# EAGLE design T00R20 (EAGLE 9.2.2)
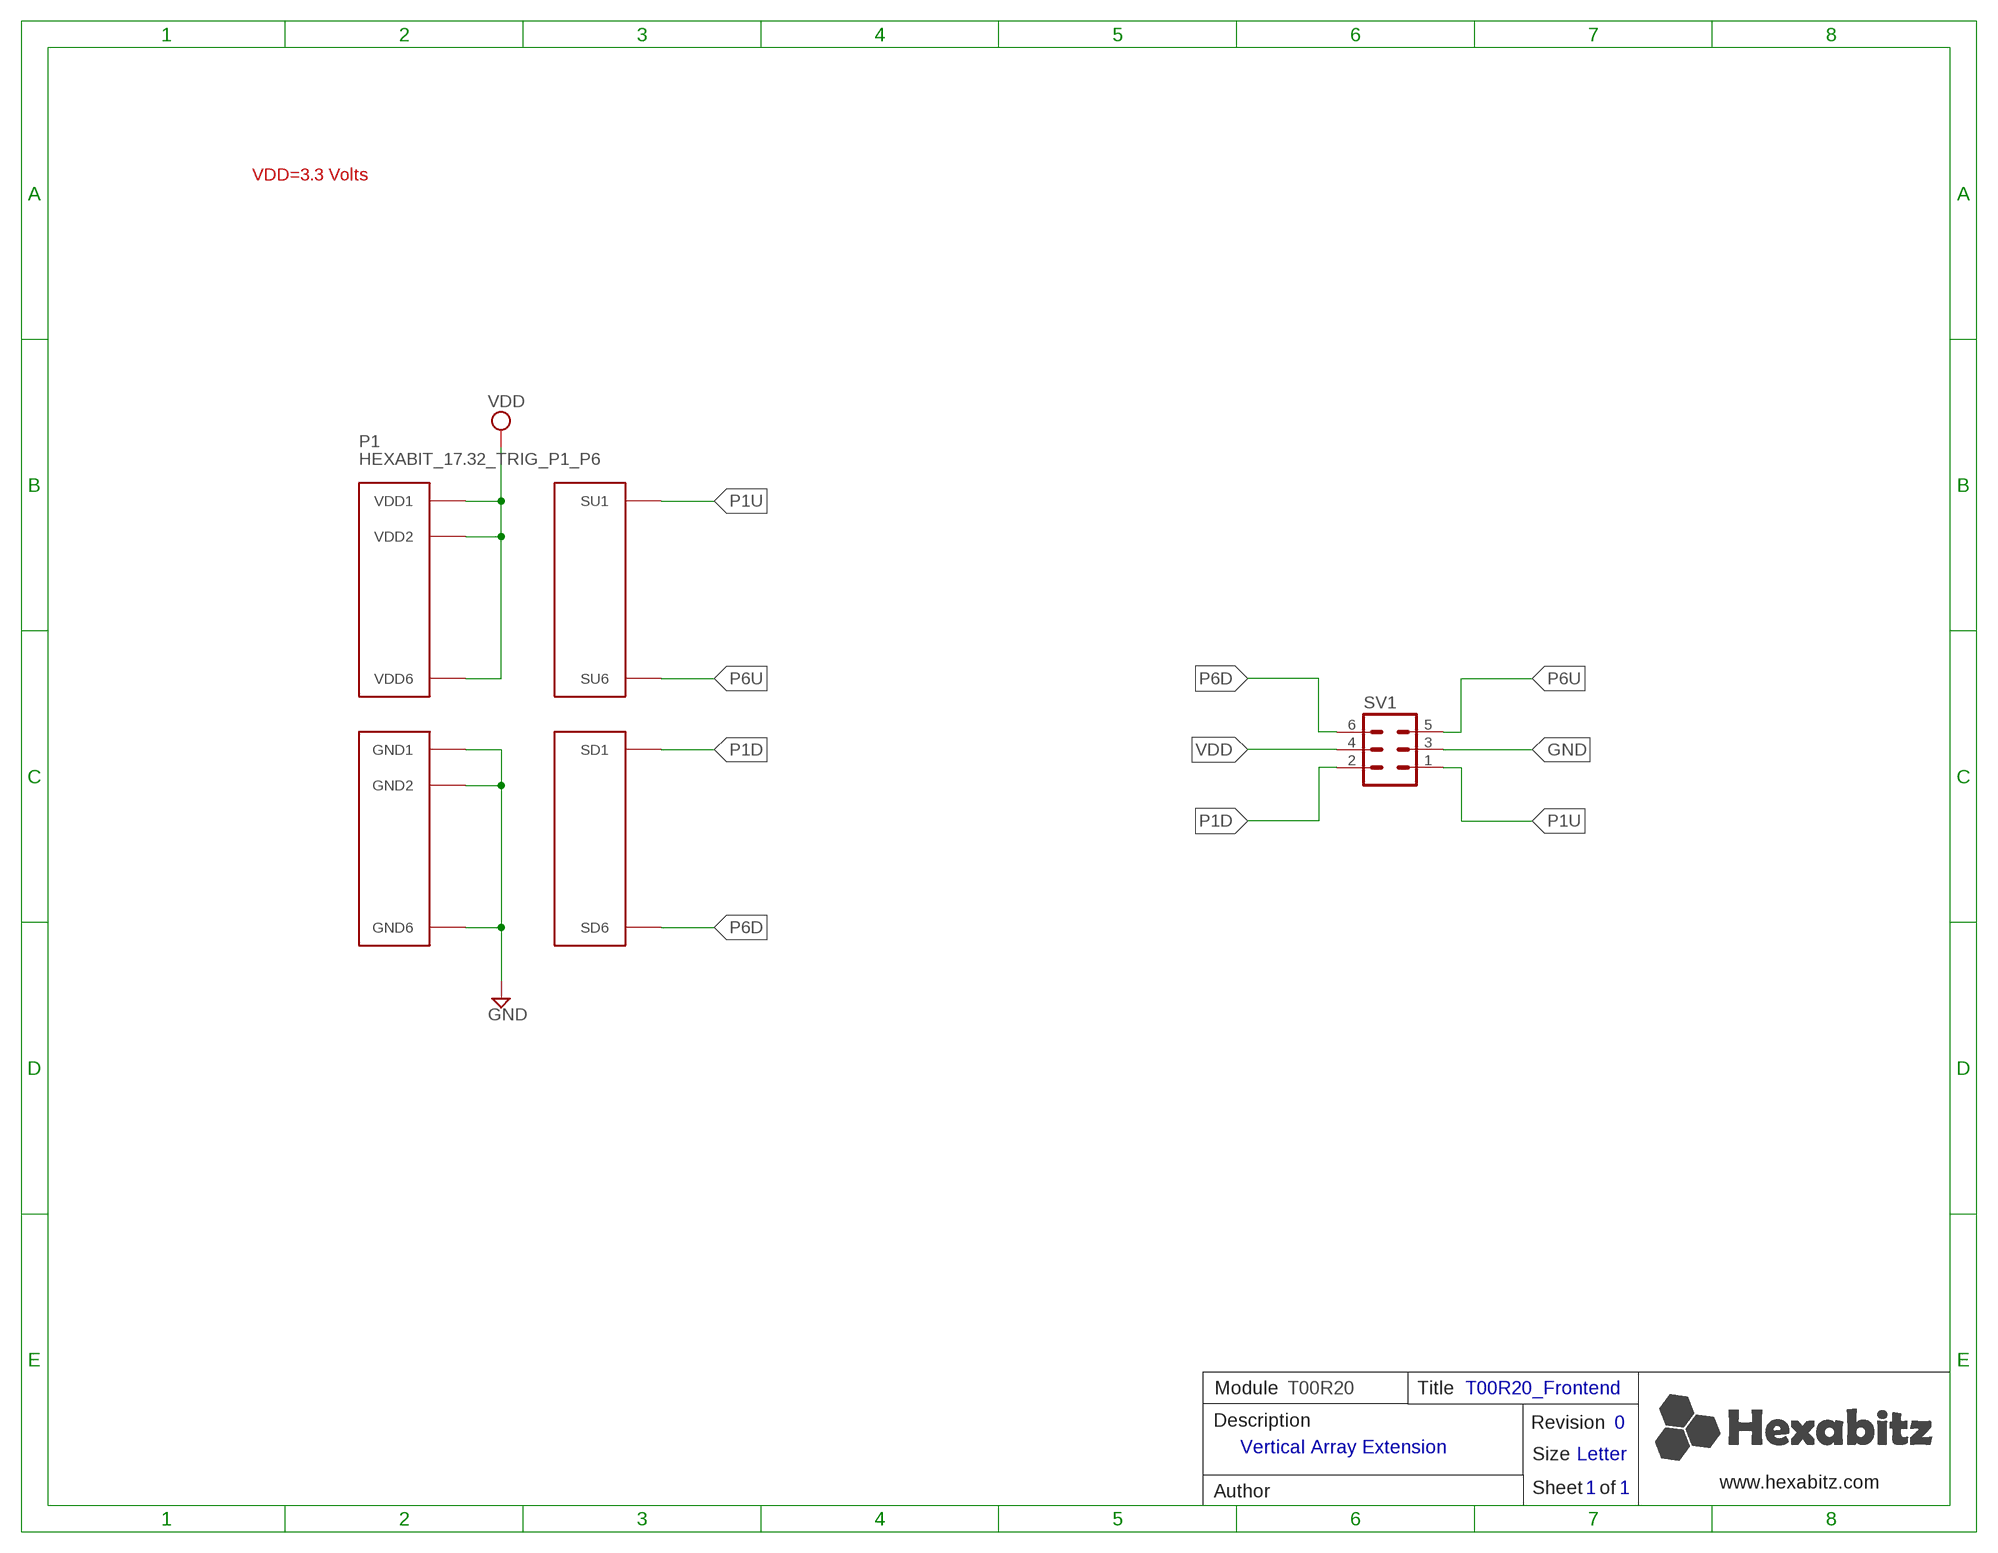
[diagram p0: schematic, sheet 1]

## Parts
P1  HEXABIT_17.32_TRIG_P1_P6  [HEXABIT_17.32_TRIG_P1_P6]
SV1  MA03-2  [MA03-2]

## Nets
GND: P1.PAD_PD7(GND1) P1.PAD_PD8(GND2) P1.PAD_PD12(GND6) SV1.3
P1D: P1.PAD_PD1(SD1) SV1.2
P1U: P1.PAD_PU1(SU1) SV1.1
P6D: P1.PAD_PD6(SD6) SV1.6
P6U: P1.PAD_PU6(SU6) SV1.5
VDD: P1.PAD_PU7(VDD1) P1.PAD_PU8(VDD2) P1.PAD_PU12(VDD6) SV1.4

## Notes on the sheet
- VDD=3.3 Volts
- Module | T00R20 | Title | T00R20_Frontend
- Description | Revision | 0
- Vertical Array Extension
- Size | Letter
- www.hexabitz.com
- Author | Sheet   of | 1 | 1

## Library data of the parts
P1 = hexabitz_connectors:HEXABIT_17.32_TRIG_P1_P6: Hexabitz Hexagon Module Connector Hexagon side length = 17.32mm.
SV1 = Hexabitz:MA03-2: PIN HEADER; OC_FARNELL: unknown; OC_NEWARK: unknown

## Board
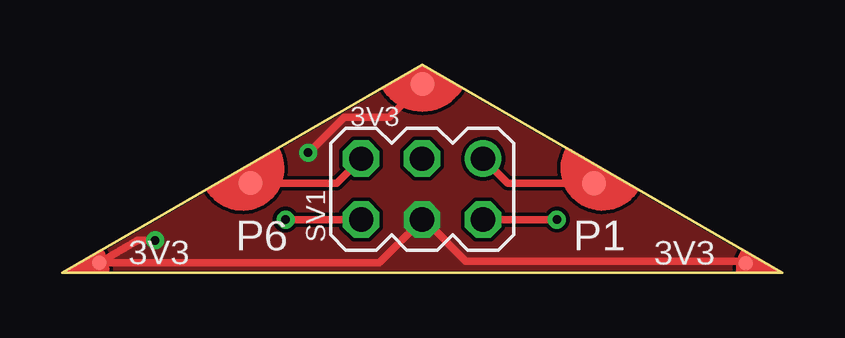
[diagram p1: board, top side]
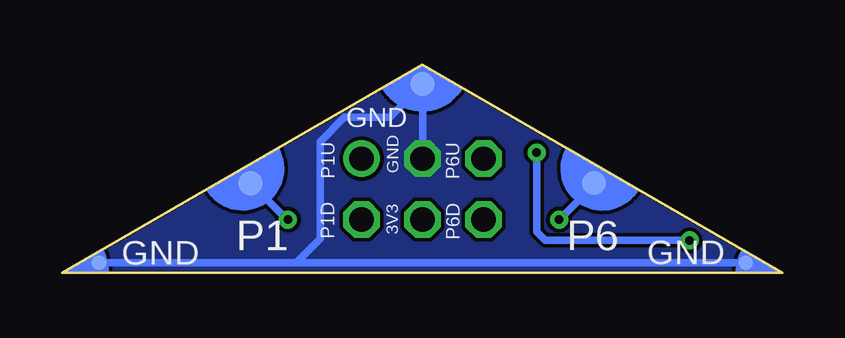
[diagram p2: board, bottom side, seen from below]

Size 30 x 8.66 mm. Coordinates in mm from the lower left corner, seen from the top.
Copper layers (1*16): Top 0.035mm / dielectric 1.5mm / Bottom 0.035mm
Design rules "2_layer *": minimum track width 7mil, minimum drill 10mil, track to track 6mil, track to pad 32mil, pad to pad 32mil, via to via 6mil, smd to smd 0mil, copper to edge 1mil, drill to drill 8mil, minimum pad ring 10mil, minimum via ring 8mil, stop-mask expansion 2mil, vias tented up to drill 15mil, thermal gap 10mil

### Footprints (pad centres in the part's own frame; a part is rotated, then mirrored left to right if it is on the bottom)
HEXABIT_17.32_TRIG_P1_P6 = smd 1 x 1 rotated 30 bottom: PAD_PD1 7.164,3.727; PAD_PD6 -7.146,3.733; PAD_PD7 0.008,7.863 | smd 0.61 x 0.61 rotated 30 bottom: PAD_PD8 13.484,0.417; PAD_PD12 -13.461,0.416 | smd 1 x 1 rotated 30: PAD_PU1 7.164,3.727; PAD_PU6 -7.146,3.733; PAD_PU7 0.008,7.863 | smd 0.61 x 0.61 rotated 30: PAD_PU8 13.475,0.401; PAD_PU12 -13.461,0.416
MA03-2 = drill 1.016: 1 -2.54,-1.27 | drill 1.016 octagon: 2 -2.54,1.27; 3 0,-1.27; 4 0,1.27; 5 2.54,-1.27; 6 2.54,1.27

### Placement (x,y rotation side)
P1  14.99,0 0 top
SV1  14.99,3.48 180 top

### Tracks (layer width: path | path; a pad name or v marks a point on that pad's centre or on a via)
GND
  Bottom 0.305: SV1.3 P1.PAD_PD7 | P1.PAD_PD7 | P1.PAD_PD12 20.25,0.42 | 20.25,0.42 P1.PAD_PD8 | P1.PAD_PD7 16.37,6.48 18.25,6.48 19.26,5.47 19.26,1.41 20.25,0.42
  pour Bottom (no thermals): -0.02,-0.01 29.97,-0.01 14.99,8.67
P1D  (via drill 0.35)
  Top 0.305: SV1.2 v20.6,2.21
  Bottom 0.305: v20.6,2.21 20.64,2.21 P1.PAD_PD1
P1U
  Top 0.305: SV1.1 18.55,3.73 P1.PAD_PU1
P6D  (via drill 0.35)
  Top 0.305: SV1.6 v9.3,2.21 9.28,2.21
  Bottom 0.305: v9.3,2.21 7.84,3.67 P1.PAD_PD6
P6U
  Top 0.305: SV1.5 11.43,3.73 P1.PAD_PU6
VDD  (via drill 0.35)
  Top 0.305: P1.PAD_PU8 28.38,0.48 16.81,0.48 15.09,2.21 SV1.4 13.2,0.42 P1.PAD_PU12 3.14,1.35 v3.86,1.35 | 14.72,7.86 P1.PAD_PU7 13.61,6.48 11.73,6.48 10.26,5 v10.24,5
  Bottom 0.305: 3.84,1.35 v3.86,1.35 9.88,1.35 10.24,1.7 v10.24,5
  pour Top (no thermals): -0.02,-0.01 29.97,-0.01 14.99,8.66

### Text on the board
tPlace: 3V3 | 3V3 | P6 | P1 | 3V3
bPlace: GND | GND | P6 | P1 | GND
bNames: P6U | P1U | GND | P6D | P1D | 3V3